# EAGLE design sensores y actuadores (EAGLE 9.6.2)
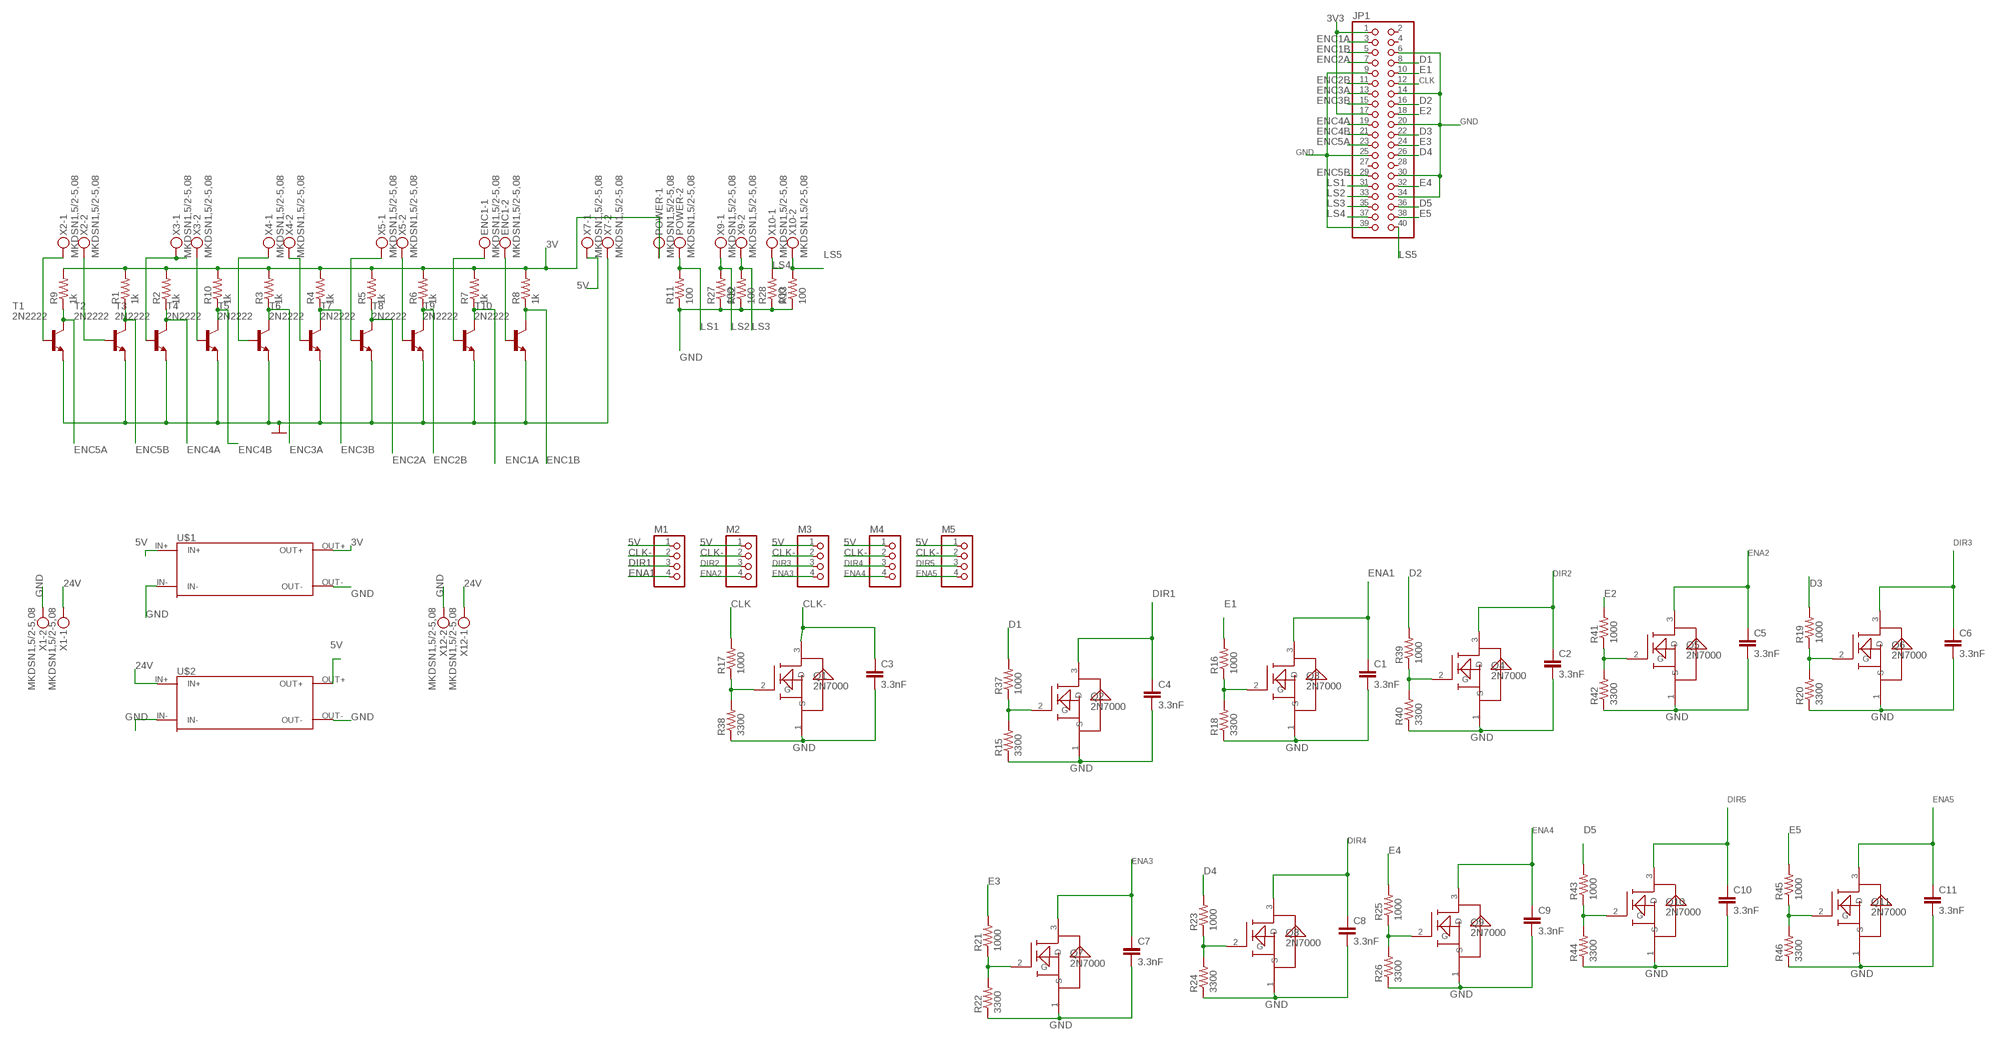
[diagram p0: schematic, sheet 1]

## Parts
C1  3.3nF  C-EU025-024X044  [C025-024X044]
C2  3.3nF  C-EU025-024X044  [C025-024X044]
C3  3.3nF  C-EU025-024X044  [C025-024X044]
C4  3.3nF  C-EU025-024X044  [C025-024X044]
C5  3.3nF  C-EU025-024X044  [C025-024X044]
C6  3.3nF  C-EU025-024X044  [C025-024X044]
C7  3.3nF  C-EU025-024X044  [C025-024X044]
C8  3.3nF  C-EU025-024X044  [C025-024X044]
C9  3.3nF  C-EU025-024X044  [C025-024X044]
C10  3.3nF  C-EU025-024X044  [C025-024X044]
C11  3.3nF  C-EU025-024X044  [C025-024X044]
ENC1  MKDSN1,5/2-5,08  [MKDSN1,5/2-5,08]
JP1  PINHD-2X20  [2X20]
M1  PINHD-1X4  [1X04]
M2  PINHD-1X4  [1X04]
M3  PINHD-1X4  [1X04]
M4  PINHD-1X4  [1X04]
M5  PINHD-1X4  [1X04]
POWER  MKDSN1,5/2-5,08  [MKDSN1,5/2-5,08]
Q1  2N7000  [2N7000]
Q2  2N7000  [2N7000]
Q3  2N7000  [2N7000]
Q4  2N7000  [2N7000]
Q5  2N7000  [2N7000]
Q6  2N7000  [2N7000]
Q7  2N7000  [2N7000]
Q8  2N7000  [2N7000]
Q9  2N7000  [2N7000]
Q10  2N7000  [2N7000]
Q11  2N7000  [2N7000]
R1  1k  R-US_0207/10  [0207/10]
R2  1k  R-US_0207/10  [0207/10]
R3  1k  R-US_0207/10  [0207/10]
R4  1k  R-US_0207/10  [0207/10]
R5  1k  R-US_0207/10  [0207/10]
R6  1k  R-US_0207/10  [0207/10]
R7  1k  R-US_0207/10  [0207/10]
R8  1k  R-US_0207/10  [0207/10]
R9  1k  R-US_0207/10  [0207/10]
R10  1k  R-US_0207/10  [0207/10]
R11  100  R-US_0207/10  [0207/10]
R12  100  R-US_0207/10  [0207/10]
R13  100  R-US_0207/10  [0207/10]
R15  3300  R-US_0207/10  [0207/10]
R16  1000  R-US_0207/10  [0207/10]
R17  1000  R-US_0207/10  [0207/10]
R18  3300  R-US_0207/10  [0207/10]
R19  1000  R-US_0207/10  [0207/10]
R20  3300  R-US_0207/10  [0207/10]
R21  1000  R-US_0207/10  [0207/10]
R22  3300  R-US_0207/10  [0207/10]
R23  1000  R-US_0207/10  [0207/10]
R24  3300  R-US_0207/10  [0207/10]
R25  1000  R-US_0207/10  [0207/10]
R26  3300  R-US_0207/10  [0207/10]
R27  100  R-US_0207/10  [0207/10]
R28  100  R-US_0207/10  [0207/10]
R37  1000  R-US_0207/10  [0207/10]
R38  3300  R-US_0207/10  [0207/10]
R39  1000  R-US_0207/10  [0207/10]
R40  3300  R-US_0207/10  [0207/10]
R41  1000  R-US_0207/10  [0207/10]
R42  3300  R-US_0207/10  [0207/10]
R43  1000  R-US_0207/10  [0207/10]
R44  3300  R-US_0207/10  [0207/10]
R45  1000  R-US_0207/10  [0207/10]
R46  3300  R-US_0207/10  [0207/10]
T1  2N2222  [2N2222]
T2  2N2222  [2N2222]
T3  2N2222  [2N2222]
T4  2N2222  [2N2222]
T5  2N2222  [2N2222]
T6  2N2222  [2N2222]
T7  2N2222  [2N2222]
T8  2N2222  [2N2222]
T9  2N2222  [2N2222]
T10  2N2222  [2N2222]
U$1  LM2596  [LM2596]
U$2  LM2596  [LM2596]
X1  MKDSN1,5/2-5,08  [MKDSN1,5/2-5,08]
X2  MKDSN1,5/2-5,08  [MKDSN1,5/2-5,08]
X3  MKDSN1,5/2-5,08  [MKDSN1,5/2-5,08]
X4  MKDSN1,5/2-5,08  [MKDSN1,5/2-5,08]
X5  MKDSN1,5/2-5,08  [MKDSN1,5/2-5,08]
X7  MKDSN1,5/2-5,08  [MKDSN1,5/2-5,08]
X9  MKDSN1,5/2-5,08  [MKDSN1,5/2-5,08]
X10  MKDSN1,5/2-5,08  [MKDSN1,5/2-5,08]
X12  MKDSN1,5/2-5,08  [MKDSN1,5/2-5,08]

## Nets
3V: POWER.1 R1.2 R2.2 R3.2 R4.2 R5.2 R6.2 R7.2 R8.2 R9.2 R10.2 U$1.OUT+
3V3: JP1.1 JP1.17
5V: M1.1 M2.1 M3.1 M4.1 M5.1 U$1.IN+ U$2.OUT+ X7.1
24V: U$2.IN+ X1.1 X12.1
CLK [clock]: JP1.12 R17.2
CLK- [clock]: C3.1 M1.2 M2.2 M3.2 M4.2 M5.2 Q1.3(D)
D1: JP1.8 R37.2
D2: JP1.16 R39.2
D3: JP1.22 R19.2
D4: JP1.26 R23.2
D5: JP1.36 R43.2
DIR1: C4.1 M1.3 Q2.3(D)
DIR2: C2.1 M2.3 Q4.3(D)
DIR3: C6.1 M3.3 Q6.3(D)
DIR4: C8.1 M4.3 Q8.3(D)
DIR5: C10.1 M5.3 Q10.3(D)
E1: JP1.10 R16.2
E2: JP1.18 R41.2
E3: JP1.24 R21.2
E4: JP1.32 R25.2
E5: JP1.38 R45.2
ENA1: C1.1 M1.4 Q3.3(D)
ENA2: C5.1 M2.4 Q5.3(D)
ENA3: C7.1 M3.4 Q7.3(D)
ENA4: C9.1 M4.4 Q9.3(D)
ENA5: C11.1 M5.4 Q11.3(D)
ENC1A: JP1.3 R7.1 T9.C
ENC1B: JP1.5 R8.1 T10.C
ENC2A: JP1.7 R5.1 T7.C
ENC2B: JP1.11 R6.1 T8.C
ENC3A: JP1.13 R3.1 T5.C
ENC3B: JP1.15 R4.1 T6.C
ENC4A: JP1.19 R2.1 T3.C
ENC4B: JP1.21 R10.1 T4.C
ENC5A: JP1.23 R9.1 T1.C
ENC5B: JP1.29 R1.1 T2.C
GND: C1.2 C2.2 C3.2 C4.2 C5.2 C6.2 C7.2 C8.2 C9.2 C10.2 C11.2 JP1.6 JP1.9 JP1.14 JP1.20 JP1.25 JP1.30 JP1.34 JP1.39 Q1.1(S) Q2.1(S) Q3.1(S) Q4.1(S) Q5.1(S) Q6.1(S) Q7.1(S) Q8.1(S) Q9.1(S) Q10.1(S) Q11.1(S) R11.1 R12.1 R13.1 R15.1 R18.1 R20.1 R22.1 R24.1 R26.1 R27.1 R28.1 R38.1 R40.1 R42.1 R44.1 R46.1 T1.E T2.E T3.E T4.E T5.E T6.E T7.E T8.E T9.E T10.E U$1.IN- U$1.OUT- U$2.IN- U$2.OUT- X1.2 X7.2 X12.2
LS1: JP1.31 POWER.2 R11.2
LS2: JP1.33 R27.2 X9.1
LS3: JP1.35 R12.2 X9.2
LS4: JP1.37 R28.2 X10.1
LS5: JP1.40 R13.2 X10.2
N$1: T1.B X2.1
N$2: T4.B X3.2
N$3: T2.B X2.2
N$4: T3.B X3.1
N$5: T5.B X4.1
N$6: T6.B X4.2
N$7: T7.B X5.1
N$8: T8.B X5.2
N$9: ENC1.1 T9.B
N$10: ENC1.2 T10.B
N$25 [clock]: Q1.2(G) R17.1 R38.2
N$36 [dir y ena]: Q2.2(G) R15.2 R37.1
N$37 [dir y ena]: Q3.2(G) R16.1 R18.2
N$38 [dir y ena]: Q4.2(G) R39.1 R40.2
N$39 [dir y ena]: Q5.2(G) R41.1 R42.2
N$40 [dir y ena]: Q6.2(G) R19.1 R20.2
N$41 [dir y ena]: Q7.2(G) R21.1 R22.2
N$42 [dir y ena]: Q8.2(G) R23.1 R24.2
N$43 [dir y ena]: Q9.2(G) R25.1 R26.2
N$44 [dir y ena]: Q10.2(G) R43.1 R44.2
N$45 [dir y ena]: Q11.2(G) R45.1 R46.2
Unconnected: JP1.2 JP1.4 JP1.27 JP1.28

## Library data of the parts
C1-C11 = rcl:C-EU: CAPACITOR, European symbol; SPICEPREFIX: C
ENC1 POWER X1-X5 X7 X9 X10 X12 = local:MKDSN1,5/2-5,08: MKDSN 1,5/ 2-5,08 Printklemme Nennstrom: 13,5 A Nennspannung: 250 V Rastermaß: 5,08 mm Polzahl: 2 Anschlussart: Schraubanschluss Montage: Löten Anschlussrichtung Leiter/Platine: 0 ° Artikelnummer: 1729128 Source: http://eshop.phoenixcontact.com .. 1729128.pdf
JP1 = pinhead:PINHD-2X20: PIN HEADER
M1-M5 = pinhead:PINHD-1X4: PIN HEADER
Q1-Q11 = local:2N7000
R1-R13 R15-R28 R37-R46 = rcl:R-US_: RESISTOR, American symbol; SPICEPREFIX: R
T1-T10 = local:2N2222: NPN TRANSISTOR
U$1 U$2 = local:LM2596

## Net classes
1 power: width 2.23 mm
3 dir y ena: width 0.002 mm
4 clock: width 0.02 mm

## Board
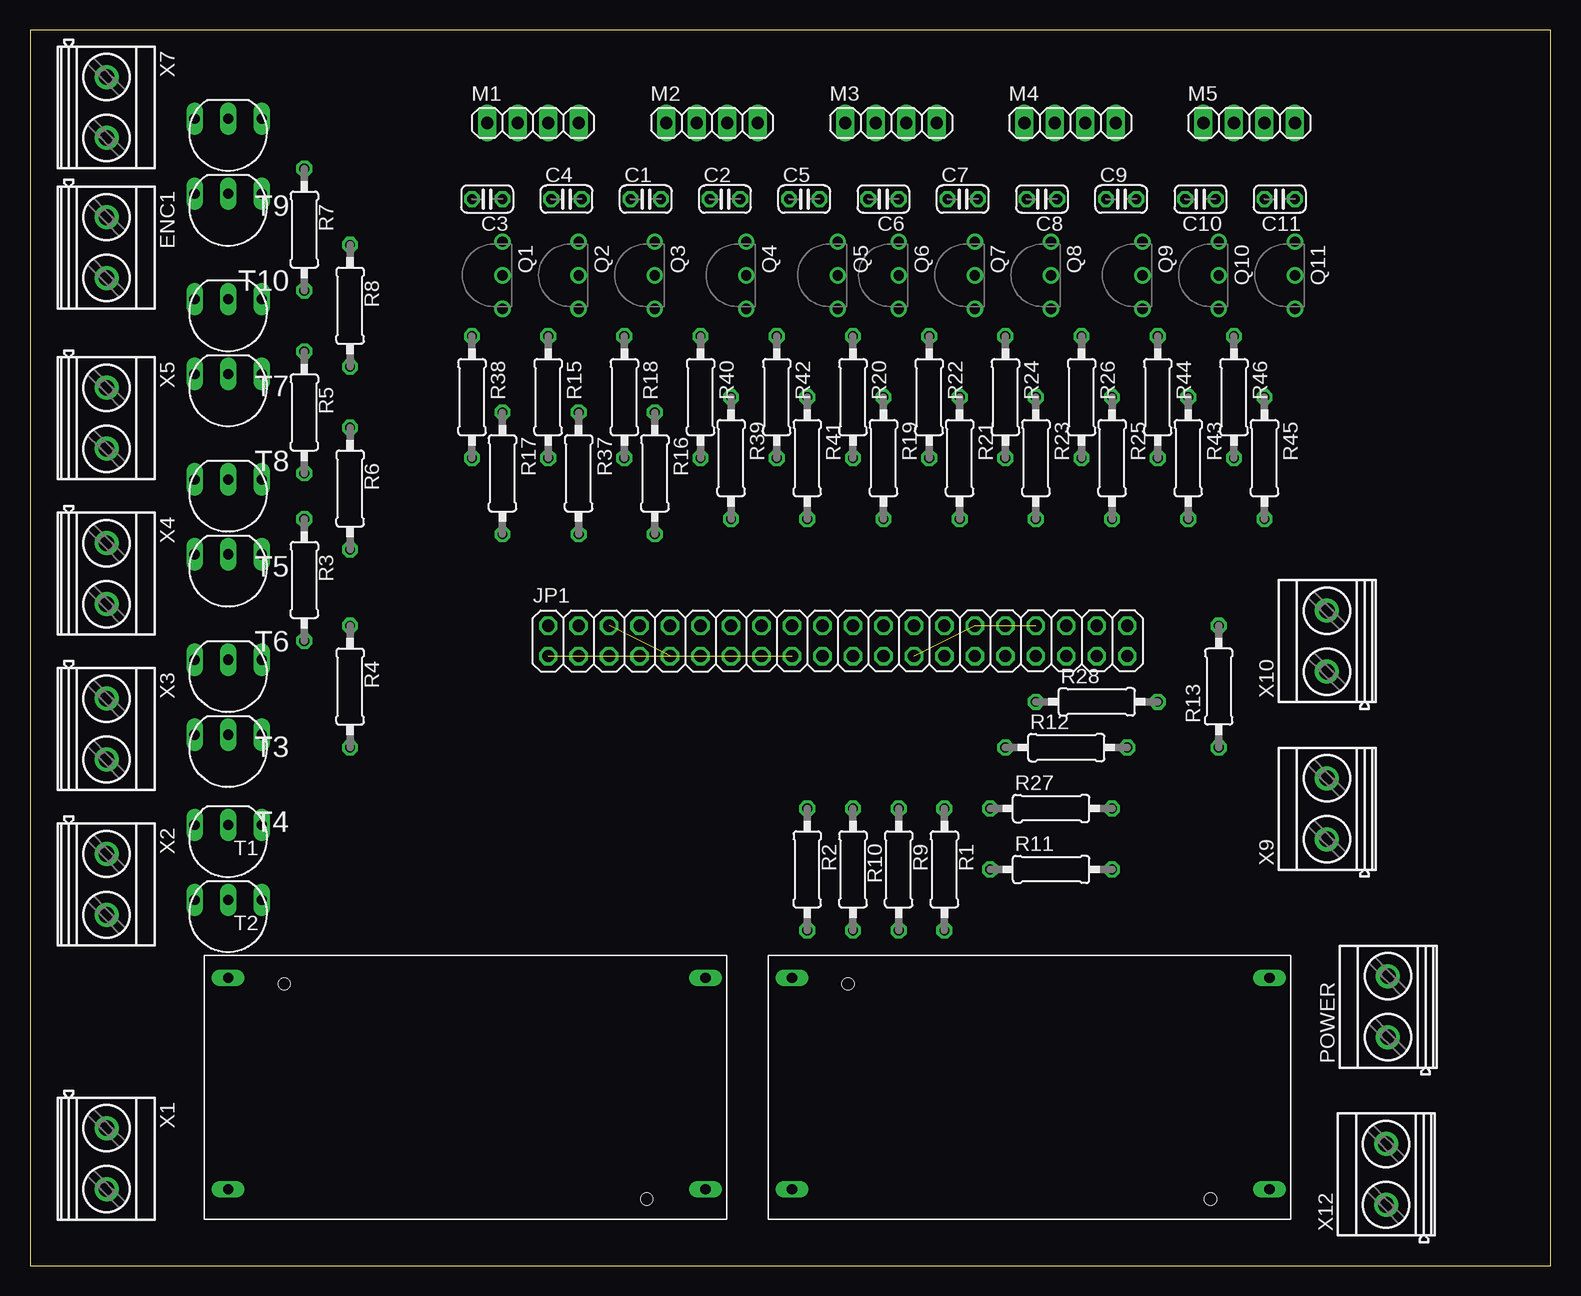
[diagram p1: board, top side]
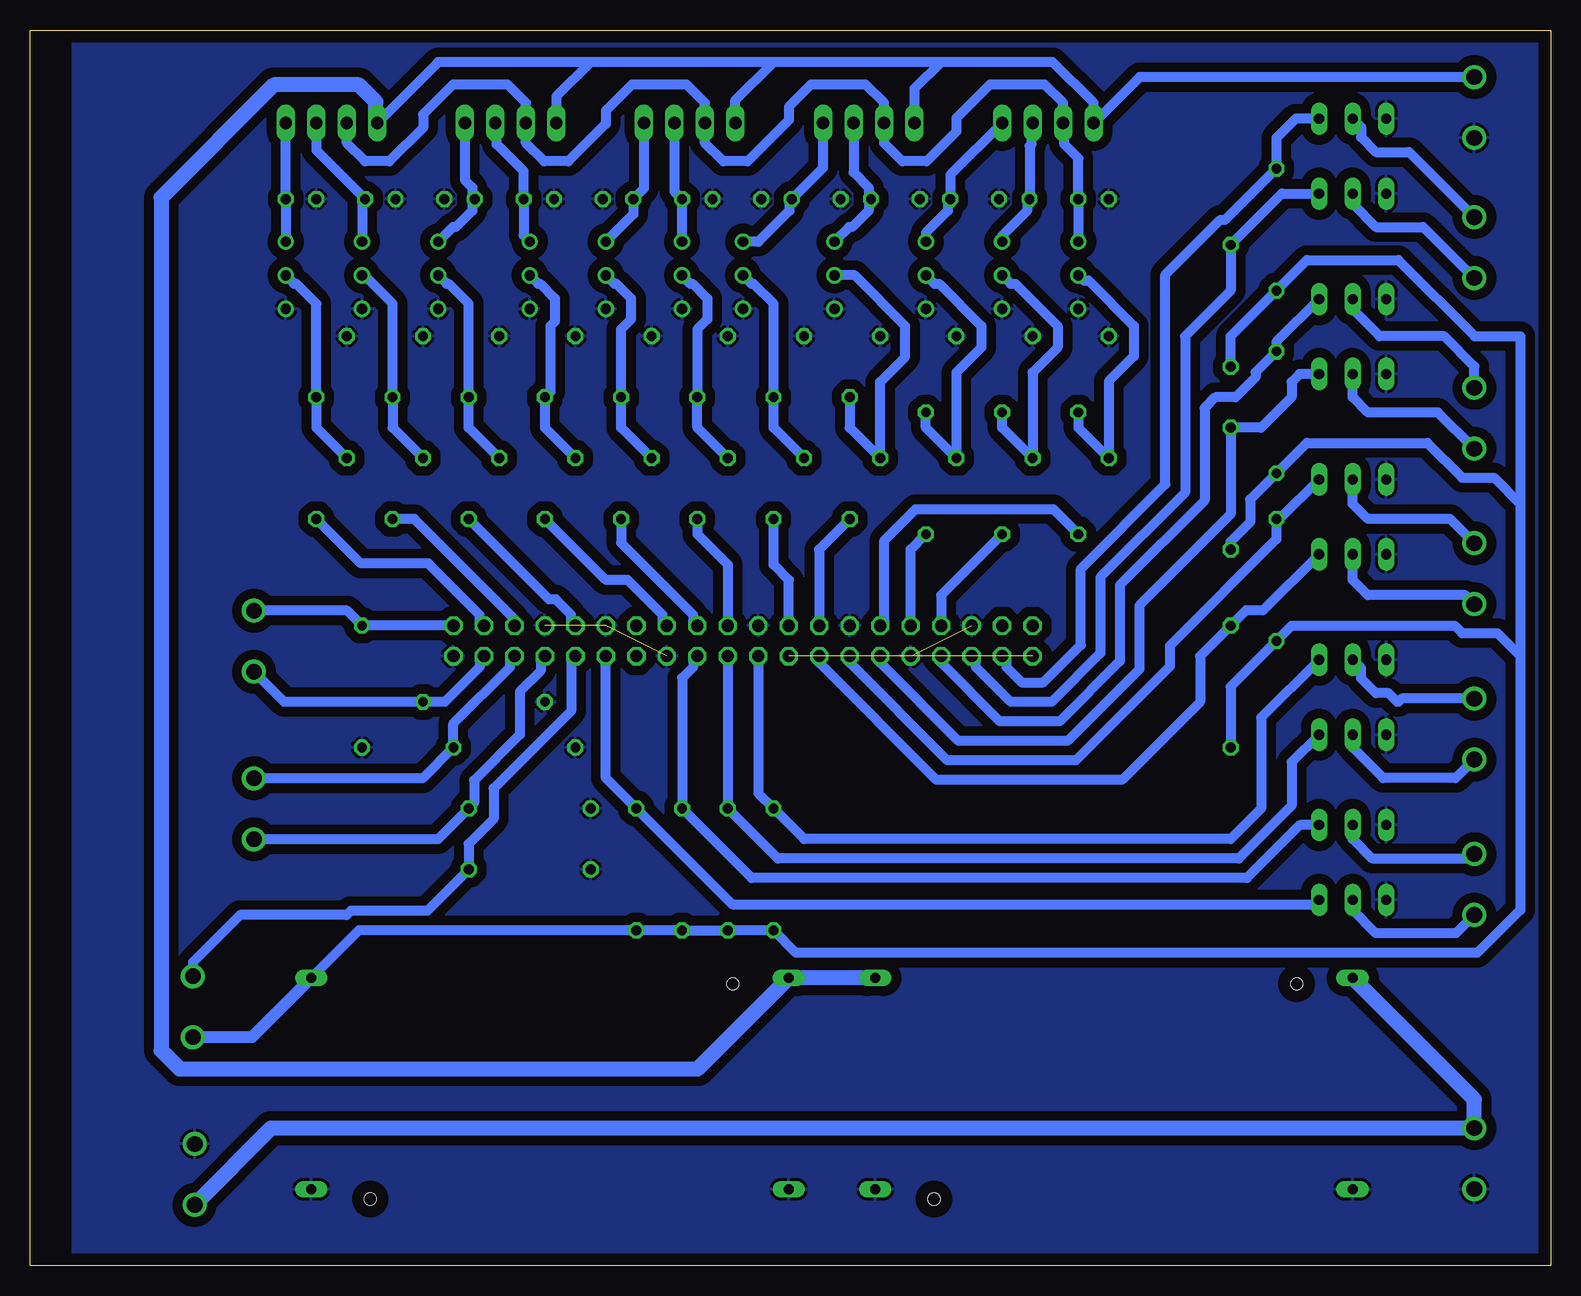
[diagram p2: board, bottom side, seen from below]

Size 126.73 x 103 mm. Coordinates in mm from the lower left corner, seen from the top.
Outline: 0,0 126.73,0 126.73,103 0,103 0,0
Copper layers (1*16): Top 0.035mm / dielectric 1.5mm / Bottom 0.035mm
Design rules "default *": minimum track width 32mil, minimum drill 0.35mm, track to track 32mil, track to pad 40mil, pad to pad 32mil, via to via 32mil, smd to smd 6mil, copper to edge 40mil, drill to drill 32mil, minimum pad ring 10mil, minimum via ring 8mil, stop-mask expansion 4mil, vias tented up to drill 0mil, thermal gap 10mil

### Footprints (pad centres in the part's own frame; a part is rotated, then mirrored left to right if it is on the bottom)
C025-024X044 = drill 0.813 octagon: 1 -1.27,0; 2 1.27,0
MKDSN1,5/2-5,08 = drill 1.3 pad 2: 1 -2.561,0.025; 2 2.519,0.025
2X20 = drill 1.016 octagon: 1 -24.13,-1.27; 2 -24.13,1.27; 3 -21.59,-1.27; 4 -21.59,1.27; 5 -19.05,-1.27; 6 -19.05,1.27; 7 -16.51,-1.27; 8 -16.51,1.27; 9 -13.97,-1.27; 10 -13.97,1.27; 11 -11.43,-1.27; 12 -11.43,1.27; 13 -8.89,-1.27; 14 -8.89,1.27; 15 -6.35,-1.27; 16 -6.35,1.27; 17 -3.81,-1.27; 18 -3.81,1.27; 19 -1.27,-1.27; 20 -1.27,1.27; 21 1.27,-1.27; 22 1.27,1.27; 23 3.81,-1.27; 24 3.81,1.27; 25 6.35,-1.27; 26 6.35,1.27; 27 8.89,-1.27; 28 8.89,1.27; 29 11.43,-1.27; 30 11.43,1.27; 31 13.97,-1.27; 32 13.97,1.27; 33 16.51,-1.27; 34 16.51,1.27; 35 19.05,-1.27; 36 19.05,1.27; 37 21.59,-1.27; 38 21.59,1.27; 39 24.13,-1.27; 40 24.13,1.27
1X04 = drill 1.016 long: 1 -3.81,0; 2 -1.27,0; 3 1.27,0; 4 3.81,0
2N7000 = drill 0.85: 1 2.8,0; 2 0,0; 3 -2.8,0
0207/10 = drill 0.813 octagon: 1 -5.08,0; 2 5.08,0
2N2222 = drill 0.85 long: B 0,0; C -2.8,0; E 2.8,0
LM2596 = drill 0.85 long: IN+ 0,17.62; IN- 0,0; OUT+ 39.79,17.62; OUT- 39.79,0 | hole 1: 4.67,17.14; 34.88,-0.8

### Placement (x,y rotation side)
C1  51.31,88.9 0 top
C2  57.91,88.9 0 top
C3  38.1,88.9 180 top
C4  44.7,88.9 0 top
C5  64.52,88.9 0 top
C6  71.12,88.9 180 top
C7  77.72,88.9 0 top
C8  84.33,88.9 180 top
C9  90.93,88.9 0 top
C10  97.54,88.9 180 top
C11  104.14,88.9 180 top
ENC1  6.35,84.84 270 top
JP1  67.31,52.07 0 top
M1  41.91,95.25 0 top
M2  56.83,95.25 0 top
M3  71.75,95.25 0 top
M4  86.68,95.25 0 top
M5  101.6,95.25 0 top
POWER  113.18,21.59 90 top
Q1  39.37,82.55 270 top
Q2  45.72,82.55 270 top
Q3  52.07,82.55 270 top
Q4  59.69,82.55 270 top
Q5  67.31,82.55 270 top
Q6  72.39,82.55 270 top
Q7  78.74,82.55 270 top
Q8  85.09,82.55 270 top
Q9  92.71,82.55 270 top
Q10  99.06,82.55 270 top
Q11  105.41,82.55 270 top
R1  76.2,33.02 270 top
R2  64.77,33.02 270 top
R3  22.86,57.15 270 top
R4  26.67,48.26 270 top
R5  22.86,71.12 270 top
R6  26.67,64.77 270 top
R7  22.86,86.36 270 top
R8  26.67,80.01 270 top
R9  72.39,33.02 270 top
R10  68.58,33.02 270 top
R11  85.09,33.02 0 top
R12  86.36,43.18 0 top
R13  99.06,48.26 90 top
R15  43.18,72.39 270 top
R16  52.07,66.04 270 top
R17  39.37,66.04 270 top
R18  49.53,72.39 270 top
R19  71.12,67.31 270 top
R20  68.58,72.39 270 top
R21  77.47,67.31 270 top
R22  74.93,72.39 270 top
R23  83.82,67.31 270 top
R24  81.28,72.39 270 top
R25  90.17,67.31 270 top
R26  87.63,72.39 270 top
R27  85.09,38.1 0 top
R28  88.9,46.99 0 top
R37  45.72,66.04 270 top
R38  36.83,72.39 270 top
R39  58.42,67.31 270 top
R40  55.88,72.39 270 top
R41  64.77,67.31 270 top
R42  62.23,72.39 270 top
R43  96.52,67.31 270 top
R44  93.98,72.39 270 top
R45  102.87,67.31 270 top
R46  100.33,72.39 270 top
T1  16.51,36.73 180 top
T2  16.51,30.48 180 top
T3  16.51,50.5 180 top
T4  16.51,44.25 180 top
T5  16.51,65.53 180 top
T6  16.51,59.28 180 top
T7  16.51,80.57 180 top
T8  16.51,74.32 180 top
T9  16.51,95.61 180 top
T10  16.51,89.36 180 top
U$1  63.5,6.35 0 top
U$2  16.51,6.35 0 top
X1  6.35,8.89 270 top
X2  6.35,31.75 270 top
X3  6.35,44.7 270 top
X4  6.35,57.66 270 top
X5  6.35,70.61 270 top
X7  6.35,96.52 270 top
X9  108.1,38.1 90 top
X10  108.1,52.07 90 top
X12  113.03,7.62 90 top

### Tracks (layer width: path | path; a pad name or v marks a point on that pad's centre or on a via)
3V
  Bottom 0.813: U$1.OUT+ 99.32,27.94 R1.2 R9.2 R10.2 R2.2 62.9,26.07 6.11,26.07 2.54,29.64 2.54,50.8 | R8.2 26.67,77.47 R7.2 20.32,83.82 12.7,83.82 6.35,77.47 2.54,77.47 2.54,63.5 | R6.2 26.67,60.34 25.04,61.96 25.04,63.86 R5.2 20.32,68.58 10.29,68.58 7.38,65.67 4.71,65.67 2.54,63.5 | R4.2 26.67,48.26 R3.2 21.59,53.34 8,53.34 7.38,52.72 4.46,52.72 2.54,50.8 | 2.54,63.5 2.54,50.8
  Bottom 1.016: U$1.OUT+ 108.23,19.03 POWER.1
3V3  (1 unrouted)
5V
  Bottom 0.813: M2.1 53.02,98.11 50.8,100.33 | 50.8,100.33 41.51,100.33 38.1,96.92 M1.1 34.27,99.08 X7.1 | 50.8,100.33 64.77,100.33 | M3.1 67.94,97.16 64.77,100.33 | 64.77,100.33 80.01,100.33 | 80.01,100.33 82.87,97.47 M4.1 | 80.01,100.33 92.71,100.33 M5.1
  Bottom 1.27: U$2.OUT+ U$1.IN+ 71.09,16.38 114.26,16.38 115.81,17.93 115.81,89.03 106.41,98.42 99.33,98.42 97.92,97.01 97.92,95.38 M5.1
24V
  Bottom 1.27: U$2.IN+ 6.38,13.84 X1.1 106.66,11.45 X12.1
CLK
  Bottom 0.813: JP1.12 55.52,53.7 55.52,60.45 52.93,63.04 41.45,63.04 R17.2
CLK-
  Bottom 0.813: M5.2 100.33,93.58 98.8,92.05 96.78,92.05 93.98,94.85 93.98,95.97 91.5,98.45 86.94,98.45 85.41,96.92 M4.2 85.41,93.58 83.88,92.05 81.86,92.05 78.74,95.17 78.74,96.28 76.58,98.45 72.02,98.45 70.48,96.92 M3.2 70.48,93.58 68.95,92.05 66.94,92.05 63.5,95.48 63.5,96.6 61.65,98.45 57.09,98.45 55.56,96.92 M2.2 55.56,93.58 54.03,92.05 52.01,92.05 49.53,94.53 49.53,95.65 46.73,98.45 42.17,98.45 40.64,96.92 M1.2 40.54,95.15 40.54,93.48 39.37,92.31 C3.1 Q1.3
D1
  Bottom 0.813: R37.2 50.8,55.88 JP1.8
D2
  Bottom 0.813: R39.2 60.96,59.69 JP1.16
D3
  Bottom 0.813: R19.2 71.12,60.96 68.58,58.42 JP1.22
D4
  Bottom 0.813: JP1.26 74.02,53.7 74.02,54.24 76.92,57.15 78.74,57.15 R23.2
D5
  Bottom 0.813: JP1.36 86.36,53.89 94.7,62.23 R43.2
DIR1
  Bottom 0.813: M1.3 43.28,95.15 43.28,93.48 43.43,93.33 C4.1 43.64,88.7 43.64,87.93 45.72,85.85 Q2.3
DIR2
  Bottom 0.813: M2.3 58.1,91.12 56.84,89.87 56.84,89.1 C2.1 56.84,88.7 56.84,87.93 58.21,86.56 58.48,86.56 Q4.3
DIR3
  Bottom 0.813: M3.3 73.03,89.53 C6.1 Q6.3
DIR4
  Bottom 0.813: M4.3 87.85,95.15 87.85,93.48 85.6,91.23 C8.1 85.6,85.86 Q8.3
DIR5
  Bottom 0.813: M5.3 102.87,92.96 C10.1 99.06,88.65 Q10.3
E1
  Bottom 0.813: JP1.10 53.34,59.69 R16.2
E2
  Bottom 0.813: JP1.18 63.5,57.15 64.77,58.42 R41.2
E3
  Bottom 0.813: JP1.24 71.48,53.7 71.48,54.24 77.47,60.24 R21.2
E4
  Bottom 0.813: JP1.32 81.64,53.7 81.64,54.24 82.92,55.52 83.46,55.52 R25.2
E5
  Bottom 0.813: JP1.38 89.26,53.7 89.26,54.24 93.53,58.52 99.16,58.52 R45.2
ENA1
  Bottom 0.813: M1.4 50.04,90.93 C1.1 50.24,88.7 50.24,87.93 52.07,86.1 Q3.3
ENA2
  Bottom 0.813: M2.4 60.64,91.5 C5.1 63.45,88.7 63.45,87.93 66.03,85.35 Q5.3
ENA3
  Bottom 0.813: M3.4 75.56,89.79 C7.1 76.45,87.64 Q7.3
ENA4
  Bottom 0.813: M4.4 90.49,90.49 89.86,89.87 89.86,89.1 C9.1 89.86,88.7 89.86,87.93 91.23,86.56 91.5,86.56 Q9.3
ENA5
  Bottom 0.813: M5.4 C11.1 Q11.3
ENC1A
  Bottom 0.813: JP1.3 45.36,50.44 45.36,49.9 44.09,48.62 42.27,48.62 39.17,51.72 39.17,58.06 32.11,65.13 32.11,82.6 27.53,87.17 27.13,87.17 R7.1 22.86,93.98 21.23,95.61 T9.C
ENC1B
  Bottom 0.813: T10.C 22.4,89.36 R8.1 26.67,81.28 30.48,77.47 30.48,64.45 37.54,57.39 37.54,51.05 41.6,46.99 45,46.99 47.9,49.9 47.9,50.44 JP1.5
ENC2A
  Bottom 0.813: JP1.7 50.8,50.25 45.91,45.36 40.93,45.36 35.92,50.38 35.92,56.72 28.85,63.78 28.85,71.48 27.94,72.39 26.26,72.39 24.59,74.07 24.59,74.47 R5.1 22.86,77.02 T7.C
ENC2B
  Bottom 0.813: JP1.11 55.88,50.25 49.37,43.74 40.26,43.74 34.29,49.7 34.29,55.02 26.67,62.64 R6.1 24.13,69.85 21.59,72.39 21.59,73.66 20.93,74.32 T8.C
ENC3A
  Bottom 0.813: JP1.13 58.42,50.25 50.28,42.11 39.58,42.11 31.75,49.95 31.75,51.66 22.86,60.55 R3.1 22.61,62.23 T5.C
ENC3B
  Bottom 0.813: JP1.15 60.96,50.25 51.2,40.49 35.71,40.49 29.21,46.99 29.21,50.8 R4.1 25.4,54.61 23.98,54.61 T6.C
ENC4A
  Bottom 0.813: T3.C 24.13,45.68 24.13,38.1 26.67,35.56 62.23,35.56 R2.1 66.04,39.37 JP1.19
ENC4B
  Bottom 0.813: T4.C 21.59,41.97 21.59,38.34 26,33.93 64.41,33.93 R10.1 JP1.21
ENC5A
  Bottom 0.813: T1.C 20.9,36.73 25.32,32.31 66.6,32.31 R9.1 72.39,48.98 71.48,49.9 71.48,50.44 JP1.23
ENC5B
  Bottom 0.813: JP1.29 78.74,40.64 R1.1 68.22,30.12 19.67,30.12 T2.C
GND  (3 unrouted)
  pour Bottom: 0,0 0,102.87 123.19,102.87 123.19,0
LS1
  Bottom 0.813: JP1.31 81.64,50.44 81.64,46.23 88.09,39.78 88.09,37.24 90.17,35.15 R11.2 93.62,29.57 99.99,29.57 100.35,29.21 109.22,29.21 113.16,25.27 POWER.2
LS2
  Bottom 0.813: JP1.33 84.18,50.44 84.18,49.58 85.9,47.85 85.9,44.26 89.71,40.45 89.71,38.56 R27.2 92.73,35.54 X9.1
LS3
  Bottom 0.813: JP1.35 86.72,50.44 86.72,49.9 91.44,45.17 R12.2 94,40.62 X9.2
LS4
  Bottom 0.813: JP1.37 89.26,50.44 89.26,49.9 92.16,46.99 R28.2 105.56,46.99 X10.1
LS5
  Bottom 0.813: JP1.40 R13.2 100.31,54.59 X10.2
N$1
  Bottom 0.813: T1.B 16.51,35.56 14.9,33.95 6.74,33.95 X2.1
N$2
  Bottom 0.813: X3.2 7.92,40.64 13.97,40.64 16.51,43.18 T4.B
N$3
  Bottom 0.813: X2.2 7.91,27.7 14.58,27.7 16.51,29.63 T2.B
N$4
  Bottom 0.813: X3.1 12.43,47.27 12.7,46.99 12.8,46.99 13.53,47.72 14.58,47.72 15.81,48.95 15.81,49.8 T3.B
N$5
  Bottom 0.813: X4.1 8.39,62.23 15.24,62.23 16.51,63.5 T5.B
N$6
  Bottom 0.813: X4.2 7.12,55.88 15.24,55.88 16.51,57.15 T6.B
N$7
  Bottom 0.813: X5.1 6.38,74.95 8.89,77.47 14.26,77.47 16.51,79.72 T7.B
N$8
  Bottom 0.813: X5.2 9.4,71.12 15.24,71.12 16.51,72.39 T8.B
N$9
  Bottom 0.813: T9.B 15.81,94.91 15.81,94.06 14.58,92.83 11.8,92.83 ENC1.1
N$10
  Bottom 0.813: T10.B 16.51,88.51 14.58,86.58 10.64,86.58 ENC1.2
N$25
  Bottom 0.813: Q1.2 38.92,82.11 38.52,82.11 34.75,78.33 34.75,75.79 36.83,73.71 R38.2 39.37,69.85 R17.1
N$36
  Bottom 0.813: Q2.2 45.02,81.85 44.62,81.85 41.1,78.33 41.1,76.53 43.18,74.45 R15.2 45.72,69.85 R37.1
N$37
  Bottom 0.813: Q3.2 51.37,81.85 50.97,81.85 47.45,78.33 47.45,76.53 49.53,74.45 R18.2 52.07,69.85 R16.1
N$38
  Bottom 0.813: R39.1 58.42,69.85 R40.2 55.88,73.66 53.8,75.74 53.8,78.33 58.01,82.55 Q4.2
N$39
  Bottom 0.813: Q5.2 66.61,81.85 66.44,81.85 64.77,80.18 R41.1 64.77,69.85 R42.2
N$40
  Bottom 0.813: Q6.2 71.69,81.85 71.52,81.85 70.29,80.62 70.29,78.88 71.12,78.05 R19.1 71.12,69.85 R20.2
N$41
  Bottom 0.813: Q7.2 78.04,81.85 77.87,81.85 76.64,80.62 76.64,78.88 77.47,78.05 R21.1 77.47,69.85 R22.2
N$42
  Bottom 0.813: Q8.2 84.39,81.85 84.22,81.85 82.99,80.62 82.99,78.71 83.36,78.33 83.36,72.85 R23.1 83.82,69.85 R24.2
N$43
  Bottom 0.813: Q9.2 92.01,81.85 91.84,81.85 90.17,80.18 R25.1 90.17,69.85 R26.2
N$44
  Bottom 0.813: Q10.2 98.89,82.55 96.52,80.18 R43.1 96.52,69.85 R44.2
N$45
  Bottom 0.813: Q11.2 104.71,81.85 104.54,81.85 102.87,80.18 R45.1 102.87,69.85 R46.2